# EAGLE design VoltageConverter (EAGLE 7.1.0)
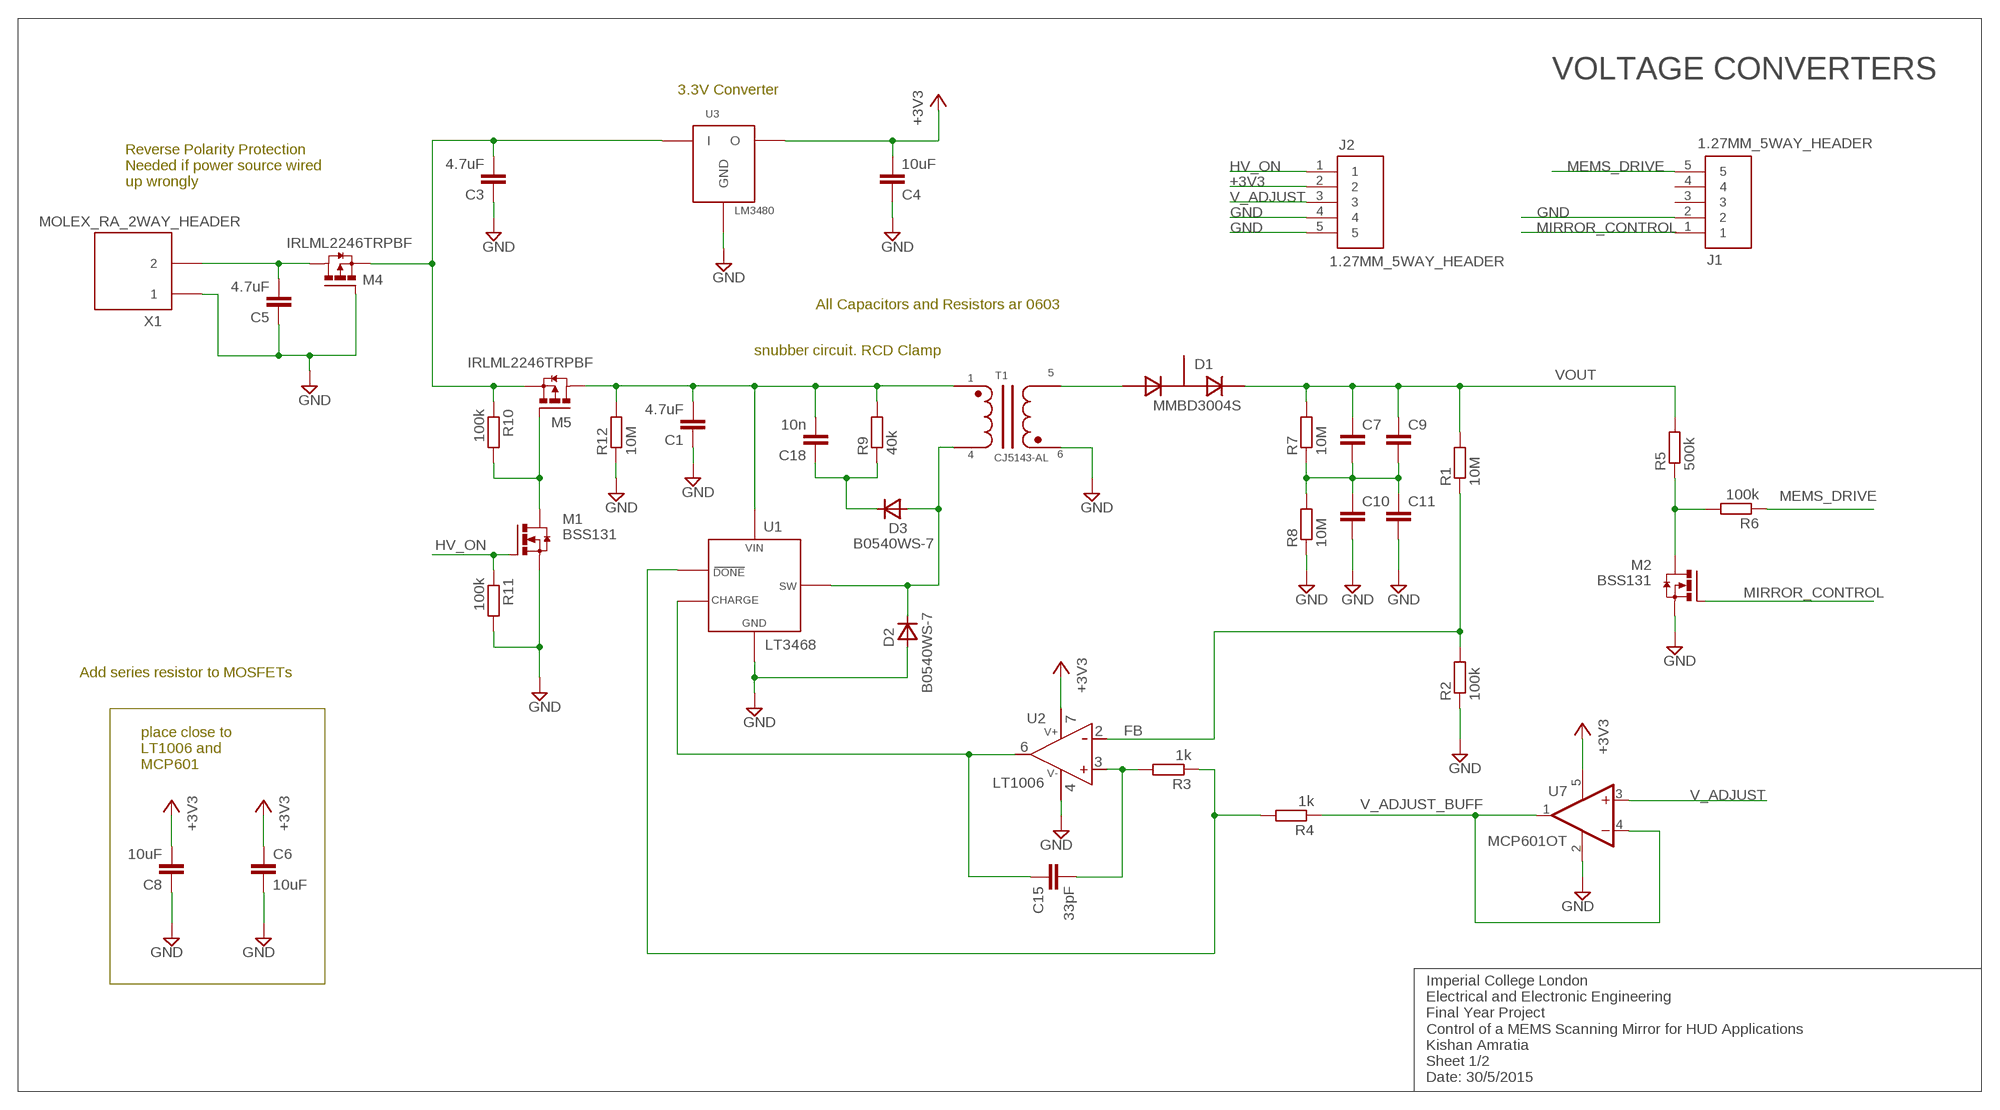
[diagram p0: schematic, sheet 1]

## Parts
C1  4.7uF  C-EUC0603K  [C0603K]
C3  4.7uF  C-EUC0603K  [C0603K]
C4  10uF  C-EUC0603  [C0603]
C5  4.7uF  C-EUC0603K  [C0603K]
C6  10uF  C-EUC0603  [C0603]
C7  C-EUC2220K  [C2220K]
C8  10uF  C-EUC0603  [C0603]
C9  C-EUC2220K  [C2220K]
C10  C-EUC2220K  [C2220K]
C11  C-EUC2220K  [C2220K]
C15  33pF  C-EUC0603  [C0603]
C18  10n  C-EUC0603K  [C0603K]
D1  MMBD3004S  [SOT-23]
D2  B0540WS-7  [SOD-323]
D3  B0540WS-7  [SOD-323]
J1  1.27MM_5WAY_HEADER  [1.27MM_5WAY_HEADER]
J2  1.27MM_5WAY_HEADER  [1.27MM_5WAY_HEADER]
M1  BSS131  [SOT-23]
M2  BSS131  [SOT-23]
M4  IRLML2246TRPBF  [SOT-23]
M5  IRLML2246TRPBF  [SOT-23]
R1  10M  R-EU_R0603  [R0603]
R2  100k  R-EU_R0603  [R0603]
R3  1k  R-EU_R0603  [R0603]
R4  1k  R-EU_R0603  [R0603]
R5  500k  R-EU_R0603  [R0603]
R6  100k  R-EU_R0603  [R0603]
R7  10M  R-EU_R0603  [R0603]
R8  10M  R-EU_R0603  [R0603]
R9  40k  R-EU_R0603  [R0603]
R10  100k  R-EU_R0603  [R0603]
R11  100k  R-EU_R0603  [R0603]
R12  10M  R-EU_R0603  [R0603]
T1  CJ5143-AL  [CJ45143-AL]
U1  LT3468  [TSOT-23]
U2  LT1006  [SOIC127P600X175-8N]
U3  LM3480  [SOT-23]
U7  MCP601OT  [SOT23-5]
X1  MOLEX_RA_2WAY_HEADER  [MOLEX_RA_2WAY_HEADER]

## Nets
+3V3: C4.2 C6.1 C8.2 J2.2 U2.7 U3.A(O) U7.5(V+)
CHARGE: C15.1 U1.4 U2.6
DONE: R3.1 R4.2 U1.3
FB: R1.1 R2.2 U2.2
GND: C1.1 C3.1 C4.1 C5.1 C6.2 C8.1 C10.2 C11.2 D2.A J1.2 J2.4 J2.5 M1.K(S) M2.K(S) M4.A(G) R2.1 R8.1 R11.2 R12.1 T1.5 U1.2 U2.4 U3.K1A2(GND) U7.2(V-) X1.P$1
HV_ON: J2.1 M1.A(G) R11.1
MEMS_DRIVE: J1.5 R6.1
MIRROR_CONTROL: J1.1 M2.A(G)
N$1: C7.2 C9.2 C10.1 C11.1 R7.1 R8.2
N$3: D1.A T1.6
N$8: C15.2 R3.2 U2.3
N$9: M2.K1A2(D) R5.1 R6.2
N$13: M1.K1A2(D) M5.A(G) R10.2
N$14: C18.1 D3.K R9.1
SW: D2.K D3.A T1.4 U1.1
V_ADJUST: J2.3 U7.3(+IN)
V_ADJUST_BUFF: R4.1 U7.1(OUT) U7.4(-IN)
V_IN: C5.2 M4.K1A2(D) X1.P$2
V_IN2: C3.2 M4.K(S) M5.K(S) R10.1 U3.K(I)
VIN_LT3468: C1.2 C18.2 M5.K1A2(D) R9.2 R12.2 T1.1 U1.5
VOUT: C7.1 C9.1 D1.K R1.2 R5.2 R7.2
Unconnected: D1.K1A2 J1.3 J1.4

## Notes on the sheet
- VOLTAGE CONVERTERS
- 3.3V Converter
- Reverse Polarity Protection
  Needed if power source wired
  up wrongly
- All Capacitors and Resistors ar 0603
- snubber circuit. RCD Clamp
- Add series resistor to MOSFETs
- place close to 
  LT1006 and 
  MCP601
- Imperial College London
  Electrical and Electronic Engineering
  Final Year Project
  Control of a MEMS Scanning Mirror for HUD Applications
  Kishan Amratia
  Sheet 1/2
  Date: 30/5/2015

## Library data of the parts
C1 C3-C11 C15 C18 = rcl:C-EU: CAPACITOR, European symbol
D1 = FYP:MMBD3004S
D2 D3 = FYP:B0540WS-7
J1 J2 = FYP:1.27MM_5WAY_HEADER
M1 M2 = FYP:BSS131
M4 M5 = FYP:IRLML2246TRPBF
R1-R12 = rcl:R-EU_: RESISTOR, European symbol
T1 = FYP:CJ5143-AL
U1 = FYP:LT3468
U2 = FYP:LT1006
U3 = FYP:LM3480
U7 = linear:MCP601: Single Op Amp 2.7V to 6.0V Single Supply CMOS Source: http://ww1.microchip.com/downloads/en/DeviceDoc/21314g.pdf
X1 = FYP:MOLEX_RA_2WAY_HEADER

## Board
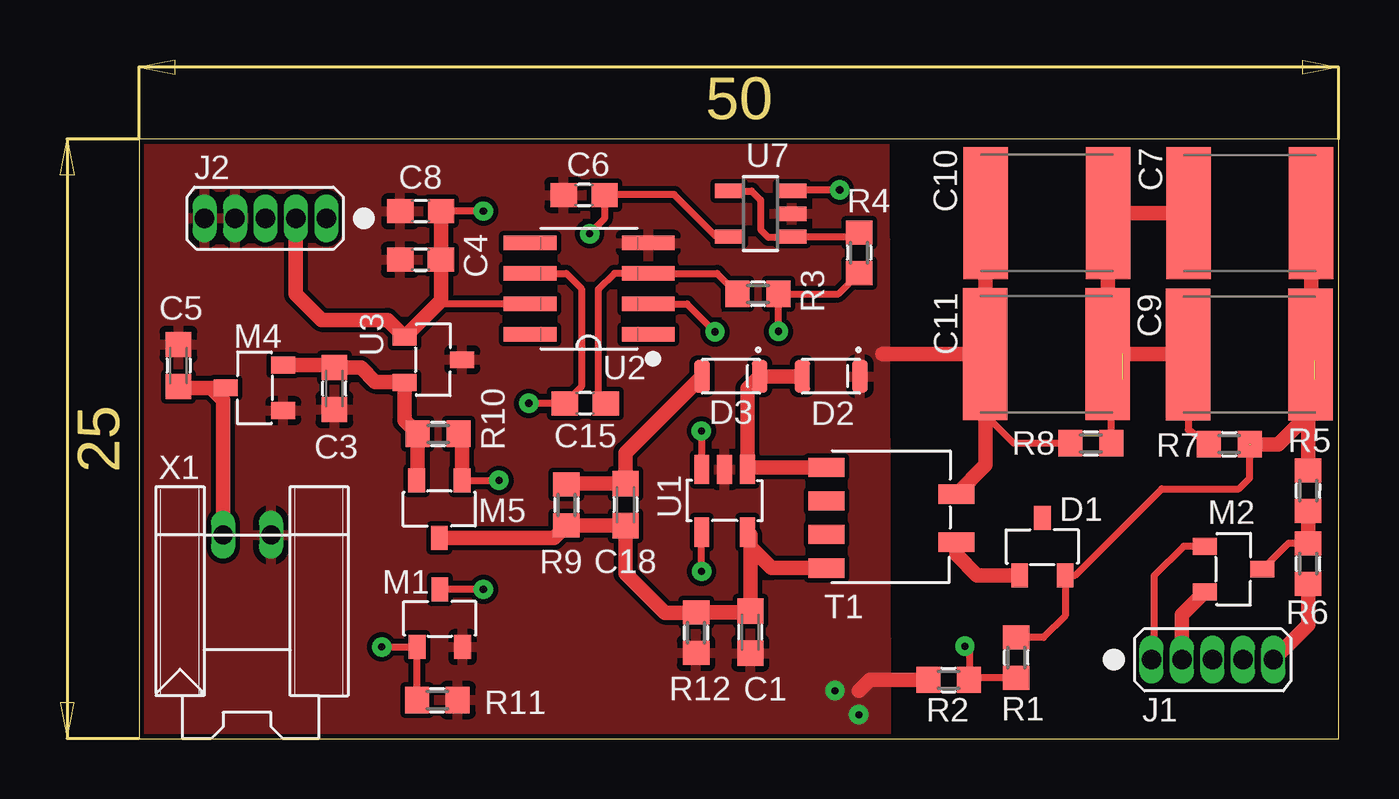
[diagram p1: board, top side]
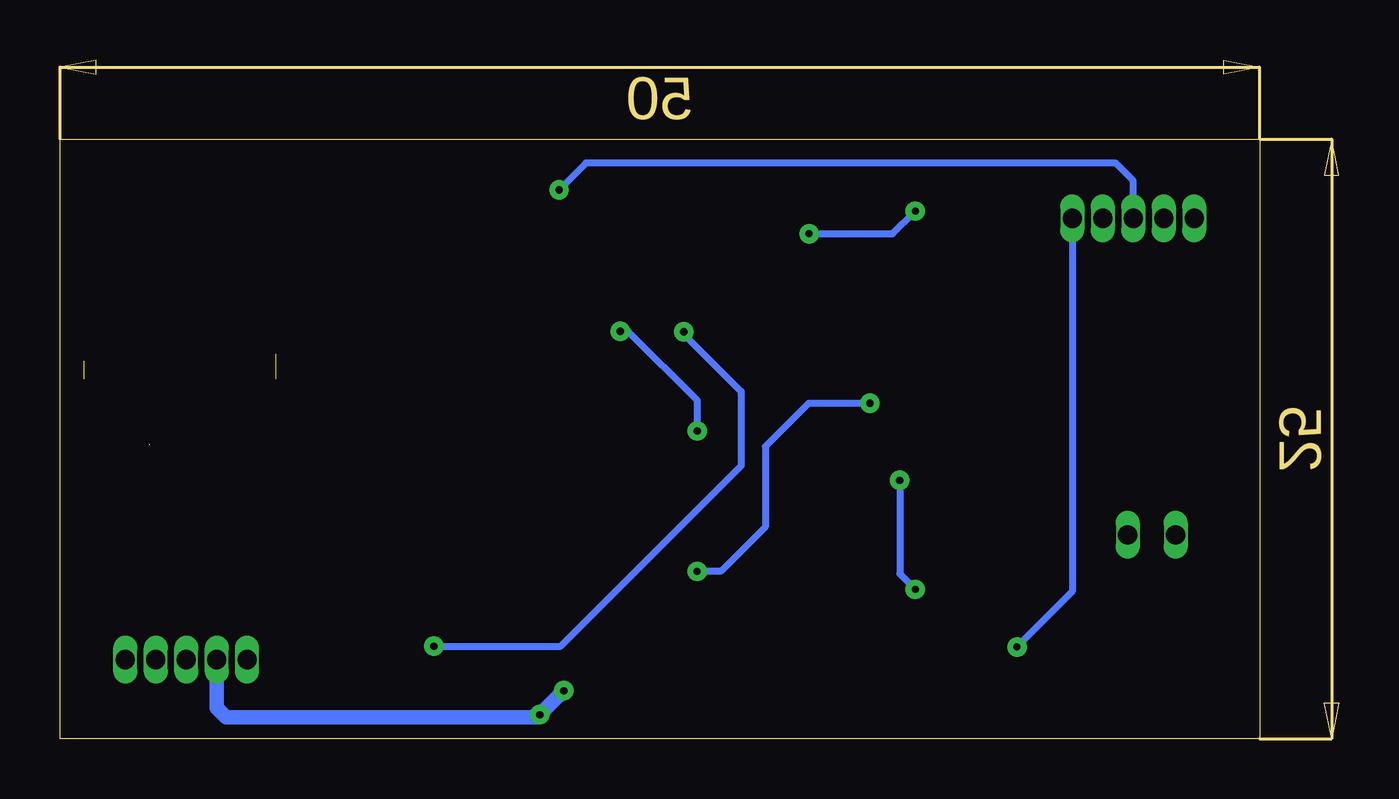
[diagram p2: board, bottom side, seen from below]

Size 50 x 25 mm. Coordinates in mm from the lower left corner, seen from the top.
Outline: 0,0 50,0 50,25 0,25 0,0
Copper layers (1*16): Top 0.035mm / dielectric 1.5mm / Bottom 0.035mm
Design rules "pcbtrain *": minimum track width 0.2mm, minimum drill 0.4mm, track to track 0.2mm, track to pad 0.2mm, pad to pad 0.2mm, via to via 0.2mm, smd to smd 0mil, copper to edge 0.2mm, drill to drill 0.2mm, minimum pad ring 4mil, minimum via ring 10mil, stop-mask expansion 0.125mm, vias tented up to drill 0mil, thermal gap 10mil

### Footprints (pad centres in the part's own frame; a part is rotated, then mirrored left to right if it is on the bottom)
C0603K = smd 1.05 x 1.08: 1 -0.875,0; 2 0.875,0
C0603 = smd 1.1 x 1: 1 -0.85,0; 2 0.85,0
C2220K = smd 1.85 x 5.5: 1 -2.55,0; 2 2.55,0
SOT-23 = smd 0.7 x 1: A -0.95,0; K 0.95,0; K1A2 0,2.4
SOD-323 = smd 0.65 x 1.35: A 0,0; K 2.4,0
1.27MM_5WAY_HEADER = drill 0.8 pad 1 long: 1 0,0; 2 1.27,0; 3 2.54,0; 4 3.81,0; 5 5.08,0
R0603 = smd 1 x 1.1: 1 -0.85,0; 2 0.85,0
CJ45143-AL = smd 1.5 x 0.8: 1 -0.22,0.01; 2 -0.22,1.41; 3 -0.22,2.81; 4 -0.22,4.21; 5 5.19,3.09; 6 5.19,1.09
TSOT-23 = smd 1.22 x 0.62: 1 -1.27,0.89; 2 -1.27,-0.06; 3 -1.27,-1.01; 4 1.35,-1.01; 5 1.35,0.89
SOIC127P600X175-8N = smd 2.2 x 0.6: 1 -2.464,1.905; 2 -2.464,0.635; 3 -2.464,-0.635; 4 -2.464,-1.905; 5 2.464,-1.905; 6 2.464,-0.635; 7 2.464,0.635; 8 2.464,1.905
SOT23-5 = smd 0.6 x 1.2: 1 -0.95,-1.306; 2 0,-1.306; 3 0.95,-1.306; 4 0.95,1.306; 5 -0.95,1.306
MOLEX_RA_2WAY_HEADER = drill 0.8 long: P$1 0,0; P$2 2,0

### Placement (x,y rotation side)
C1  25.47,4.45 90 top
C3  8.14,14.6 90 top
C4  11.73,19.97 0 top
C5  1.64,15.56 270 top
C6  18.55,22.67 180 top
C7  46.3,21.91 180 top
C8  11.74,22 0 top
C9  46.27,16.02 180 top
C10  37.84,21.92 180 top
C11  37.82,16.03 180 top
C15  18.59,13.98 0 top
C18  20.27,9.76 270 top
D1  37.65,6.81 0 top
D2  30.04,15.11 180 top
D3  25.86,15.11 180 top
J1  42.2,3.3 0 top
J2  7.8,21.7 180 top
M1  12.53,3.83 0 top
M2  44.42,7.07 270 top
M4  6.01,14.63 90 top
M5  12.51,10.77 180 top
R1  36.56,3.39 90 top
R2  33.74,2.46 0 top
R3  25.79,18.55 180 top
R4  30.01,20.26 270 top
R5  48.73,10.34 90 top
R6  48.72,7.3 90 top
R7  45.43,12.28 0 top
R8  39.67,12.31 0 top
R9  17.81,9.75 270 top
R10  12.47,12.71 0 top
R11  12.43,1.61 0 top
R12  23.21,4.42 90 top
T1  28.87,7.1 0 top
U1  24.46,9.96 270 top
U2  18.76,18.76 180 top
U3  11.06,15.8 270 top
U7  25.9,21.89 90 top
X1  5.5,8.5 180 top

### Tracks (layer width: path | path; a pad name or v marks a point on that pad's centre or on a via)
+3V3  (via drill 0.3)
  Top 0.3: C8.2 v14.35,22 | U2.7 12.72,18.13 12.58,18.27 | U7.5 24.05,20.94 22.3,22.69 19.42,22.69 C6.1 19.4,21.68 v18.77,21.06
  Top 0.6: J2.2 6.53,18.54 7.61,17.46 10.35,17.46 U3.A 12.58,18.27 C4.2 C8.2
  Bottom 0.3: v18.77,21.06 15.29,21.06 v14.35,22
CHARGE  (via drill 0.3)
  Top 0.3: U2.6 17.8,19.4 18.44,18.77 18.44,14.68 C15.1 v16.24,13.98 v16.24,13.99 | v23.45,6.98 U1.4
  Bottom 0.3: v23.45,6.98 22.45,6.98 20.6,8.83 20.6,12.18 18.79,13.99 v16.24,13.99 | v23.45,6.98
DONE  (via drill 0.3)
  Top 0.3: U1.3 23.45,12.76 v23.43,12.83 | v26.65,16.99 R3.1 29.14,18.55 R4.2
  Bottom 0.3: v26.65,16.99 26.32,16.99 23.44,14.11 23.44,12.84 v23.43,12.83
FB  (via drill 0.3)
  Top 0.3: R1.1 34.67,2.54 R2.2 34.6,2.45 34.6,4.02 34.44,3.85 v34.42,3.85 | U2.2 22.84,18.13 v24,16.96
  Bottom 0.3: v24,16.96 24,16.87 21.61,14.48 21.61,11.37 29.13,3.85 v34.42,3.85
GND  (via drill 0.3)
  Top 0.3: 39,12 38.99,12.01 R8.1 36.45,12.31 35.27,13.5
  Top 0.6: R2.1 30.46,2.46 30,2 | C11.2 35.27,21.9 C10.2 | J1.2 43.47,5.16 M2.K | C11.2 30.98,16.03 30.98,16.04 | C11.2 35.27,13.5 35.27,11.4 T1.5
  Bottom 0.6: J1.2 43.47,1.29 43.06,0.89 30.11,0.89 v29,2
  other vias: 30,1
  pour Top: 0,25 31.06,25.03 31.13,0.07 0,0
HV_ON  (via drill 0.3)
  Top 0.3: R11.1 M1.A v10.11,3.83
  Bottom 0.3: J2.1 7.8,6.14 v10.11,3.83
MEMS_DRIVE
  Top 0.6: R6.1 48.72,4.74 J1.5
MIRROR_CONTROL
  Top 0.3: M2.A 43.53,8.02 42.3,6.79 42.3,3.4 J1.1
N$1  (1 unrouted)
  Top 0.3: C9.2 43.72,12.89 R7.1 | R8.2 40.52,14.52 41,15
  Top 0.6: C7.2 C10.1 40.39,16.65 41,16.03 | C11.1 41,16.03 | 41,16.03 43.57,16.03 C9.2
N$3
  Top 0.6: T1.6 34.06,7.68 34.93,6.81 D1.A
N$8
  Top 0.3: R3.2 24.09,19.4 U2.3 19.81,19.4 19.14,18.73 19.14,14.29 C15.2
N$9
  Top 0.3: R6.2 47.9,8.15 M2.K1A2
  Top 0.6: R6.2 R5.1
N$13  (via drill 0.3)
  Top 0.3: M5.A v15,10.77 | v14.35,6.23 M1.K1A2
  Top 0.6: M5.A 13.46,12.57 R10.2
  Bottom 0.3: v15,10.77 15,6.88 v14.35,6.23
N$14
  Top 0.6: D3.K 20.27,11.92 C18.1 17.89,10.63 R9.1
SW
  Top 0.6: T1.4 25.43,11.31 U1.1 25.35,14.6 D3.A D2.K
V_ADJUST  (via drill 0.3)
  Top 0.3: 27.18,22.86 U7.3 27.25,22.88 v29.2,22.88
  Bottom 0.3: J2.3 5.26,23.26 6,24 27.18,24 28.08,24 v29.2,22.88
V_ADJUST_BUFF
  Top 0.3: U7.4 25.53,22.84 25.9,22.47 25.9,21.23 26.22,20.91 27.18,20.91 U7.1 29.84,20.94 R4.1
V_IN
  Top 0.6: M4.K1A2 3,14.63 | 3,14.63 1.69,14.63 C5.2 | X1.P$2 3.5,14.13 3,14.63
V_IN2
  Top 0.6: M4.K 8.03,15.58 C3.2 9.25,15.48 9.84,14.88 11.04,14.88 U3.K 11.06,13.26 R10.1 11.62,10.83 M5.K
VIN_LT3468
  Top 0.6: 25.47,8 C1.2 25.43,5.27 R12.2 23.19,5.25 21.92,5.25 20.27,6.9 C18.2 20.26,8.89 R9.2 17.29,8.37 M5.K1A2 | 25.47,8 25.47,8.49 U1.5 | T1.1 26.36,7.11 25.47,8
VOUT  (2 unrouted)
  Top 0.3: R1.2 36.58,4.22 37.69,4.22 38.6,5.13 D1.K 39.02,6.81 42.63,10.42 45.84,10.42 46.29,10.87 46.29,12.28 R7.2
  Top 0.6: C7.1 48.85,17.15 49,17 49,15.74 C9.1 | R5.2 48.73,13.52 | 48.73,13.52 48.73,14.73 49,15 | 46.28,12.24 46.33,12.29 46.34,12.29 46.36,12.27 47.48,12.27 48.73,13.52